# Altium project Led Strip 2 colors.PrjPcb
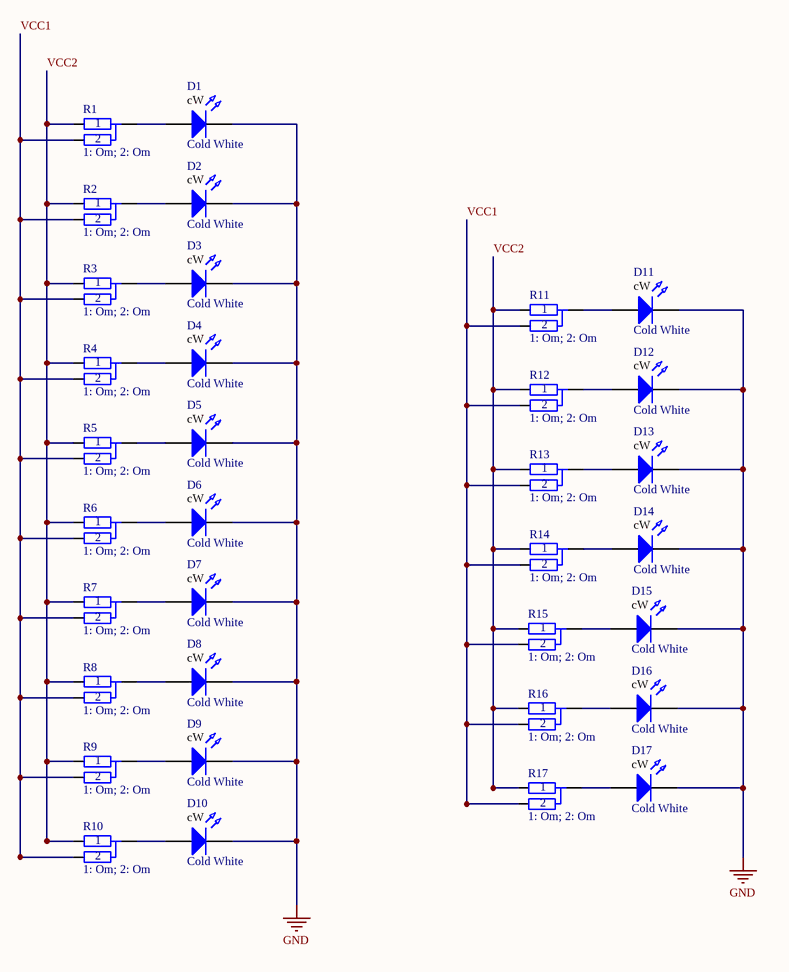
[diagram p0: Led Strip 2 colors.SchDoc]
2 sheets, 78 parts. Net scope: global (net labels, ports and power ports of the same name join across sheets).
Board files: Led Strip 2 colors.PcbDoc, Led Strip 2 colors Long.PcbDoc, Led Strip 2 colors HD.PcbDoc, Led Strip 5730 - 100mm.PcbDoc
Sheets:
  Led Strip 2 colors.SchDoc
  Led Strip 5630.SchDoc

## Sheet Led Strip 2 colors.SchDoc
size A4

### Parts
D1  Cold White  [LED SMD 5050 White compact R]
D2  Cold White  [LED SMD 5050 White compact R]
D3  Cold White  [LED SMD 5050 White compact R]
D4  Cold White  [LED SMD 5050 White compact R]
D5  Cold White  [LED SMD 5050 White compact R]
D6  Cold White  [LED SMD 5050 White compact R]
D7  Cold White  [LED SMD 5050 White compact R]
D8  Cold White  [LED SMD 5050 White compact R]
D9  Cold White  [LED SMD 5050 White compact R]
D10  Cold White  [LED SMD 5050 White compact R]
D11  Cold White  [LED SMD 5050 White compact R]
D12  Cold White  [LED SMD 5050 White compact R]
D13  Cold White  [LED SMD 5050 White compact R]
D14  Cold White  [LED SMD 5050 White compact R]
D15  Cold White  [LED SMD 5050 White compact R]
D16  Cold White  [LED SMD 5050 White compact R]
D17  Cold White  [LED SMD 5050 White compact R]
R1  1: Om; 2: Om  [SMD 0805 (2012) Double]
R2  1: Om; 2: Om  [SMD 0805 (2012) Double]
R3  1: Om; 2: Om  [SMD 0805 (2012) Double]
R4  1: Om; 2: Om  [SMD 0805 (2012) Double]
R5  1: Om; 2: Om  [SMD 0805 (2012) Double]
R6  1: Om; 2: Om  [SMD 0805 (2012) Double]
R7  1: Om; 2: Om  [SMD 0805 (2012) Double]
R8  1: Om; 2: Om  [SMD 0805 (2012) Double]
R9  1: Om; 2: Om  [SMD 0805 (2012) Double]
R10  1: Om; 2: Om  [SMD 0805 (2012) Double]
R11  1: Om; 2: Om  [SMD 0805 (2012) Double]
R12  1: Om; 2: Om  [SMD 0805 (2012) Double]
R13  1: Om; 2: Om  [SMD 0805 (2012) Double]
R14  1: Om; 2: Om  [SMD 0805 (2012) Double]
R15  1: Om; 2: Om  [SMD 0805 (2012) Double]
R16  1: Om; 2: Om  [SMD 0805 (2012) Double]
R17  1: Om; 2: Om  [SMD 0805 (2012) Double]

### Nets
GND: D1.K D2.K D3.K D4.K D5.K D6.K D7.K D8.K D9.K D10.K D11.K D12.K D13.K D14.K D15.K D16.K D17.K
VCC1: R1.2 R2.2 R3.2 R4.2 R5.2 R6.2 R7.2 R8.2 R9.2 R10.2 R11.2 R12.2 R13.2 R14.2 R15.2 R16.2 R17.2
VCC2: R1.1 R2.1 R3.1 R4.1 R5.1 R6.1 R7.1 R8.1 R9.1 R10.1 R11.1 R12.1 R13.1 R14.1 R15.1 R16.1 R17.1
NetD1_A: D1.A R1.3
NetD2_A: D2.A R2.3
NetD3_A: D3.A R3.3
NetD4_A: D4.A R4.3
NetD5_A: D5.A R5.3
NetD6_A: D6.A R6.3
NetD7_A: D7.A R7.3
NetD8_A: D8.A R8.3
NetD9_A: D9.A R9.3
NetD10_A: D10.A R10.3
NetD11_A: D11.A R11.3
NetD12_A: D12.A R12.3
NetD13_A: D13.A R13.3
NetD14_A: D14.A R14.3
NetD15_A: D15.A R15.3
NetD16_A: D16.A R16.3
NetD17_A: D17.A R17.3

### Notes on the sheet
- (in symbol Led SMD White Cold) cW

### Library data of the parts
D1-D17 = Led SMD White Cold: ?3v ?20mA; Forward Voltage TYP: ?3; Resistor for 5v VCC: 240 Om; Forward Voltage Min: ?; Wave len min/typ: ?; Liminous Min (mcd): ?; Liminous Typ (mcd): ?; Forward Amp (mA): ?; Color: Cold White
R1-R17 = Res SMD (Select one way): Choice from two resistors

## Sheet Led Strip 5630.SchDoc: Led Strip 5630
size A4; Revision: 0; SheetNumber: 1; SheetTotal: 1; Version: 1.0; Variant: Led 5630 3x in section; Modification: Modification; Project: Led Strip
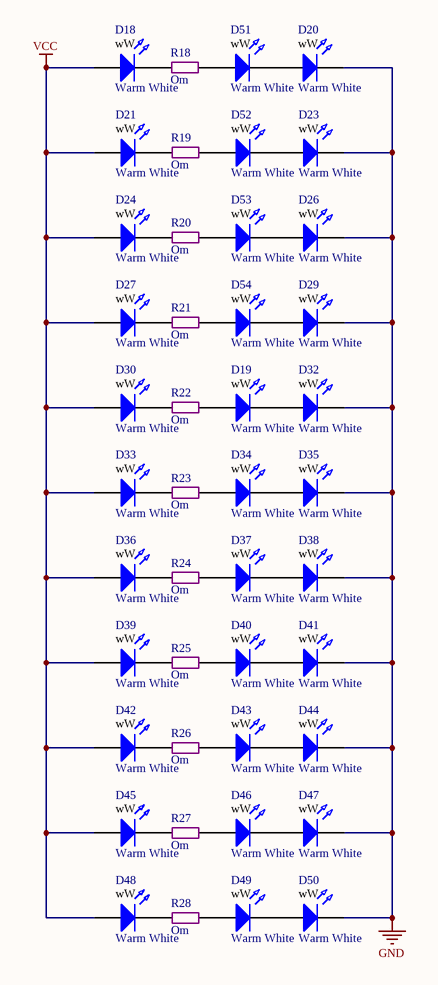
[diagram p1: Led Strip 5630.SchDoc]

### Parts
D18  Warm White  [LED SMD 5730 White]
D19  Warm White  [LED SMD 5730 White]
D20  Warm White  [LED SMD 5730 White]
D21  Warm White  [LED SMD 5730 White]
D23  Warm White  [LED SMD 5730 White]
D24  Warm White  [LED SMD 5730 White]
D26  Warm White  [LED SMD 5730 White]
D27  Warm White  [LED SMD 5730 White]
D29  Warm White  [LED SMD 5730 White]
D30  Warm White  [LED SMD 5730 White]
D32  Warm White  [LED SMD 5730 White]
D33  Warm White  [LED SMD 5730 White]
D34  Warm White  [LED SMD 5730 White]
D35  Warm White  [LED SMD 5730 White]
D36  Warm White  [LED SMD 5730 White]
D37  Warm White  [LED SMD 5730 White]
D38  Warm White  [LED SMD 5730 White]
D39  Warm White  [LED SMD 5730 White]
D40  Warm White  [LED SMD 5730 White]
D41  Warm White  [LED SMD 5730 White]
D42  Warm White  [LED SMD 5730 White]
D43  Warm White  [LED SMD 5730 White]
D44  Warm White  [LED SMD 5730 White]
D45  Warm White  [LED SMD 5730 White]
D46  Warm White  [LED SMD 5730 White]
D47  Warm White  [LED SMD 5730 White]
D48  Warm White  [LED SMD 5730 White]
D49  Warm White  [LED SMD 5730 White]
D50  Warm White  [LED SMD 5730 White]
D51  Warm White  [LED SMD 5730 White]
D52  Warm White  [LED SMD 5730 White]
D53  Warm White  [LED SMD 5730 White]
D54  Warm White  [LED SMD 5730 White]
R18  Om  [SMD 1206 (3216)]
R19  Om  [SMD 1206 (3216)]
R20  Om  [SMD 1206 (3216)]
R21  Om  [SMD 1206 (3216)]
R22  Om  [SMD 1206 (3216)]
R23  Om  [SMD 1206 (3216)]
R24  Om  [SMD 1206 (3216)]
R25  Om  [SMD 1206 (3216)]
R26  Om  [SMD 1206 (3216)]
R27  Om  [SMD 1206 (3216)]
R28  Om  [SMD 1206 (3216)]

### Nets
GND: D20.K D23.K D26.K D29.K D32.K D35.K D38.K D41.K D44.K D47.K D50.K
VCC: D18.A D21.A D24.A D27.A D30.A D33.A D36.A D39.A D42.A D45.A D48.A
NetD18_K: D18.K R18.1
NetD19_A: D19.A R22.2
NetD19_K: D19.K D32.A
NetD20_A: D20.A D51.K
NetD21_K: D21.K R19.1
NetD23_A: D23.A D52.K
NetD24_K: D24.K R20.1
NetD26_A: D26.A D53.K
NetD27_K: D27.K R21.1
NetD29_A: D29.A D54.K
NetD30_K: D30.K R22.1
NetD33_K: D33.K R23.1
NetD34_A: D34.A R23.2
NetD34_K: D34.K D35.A
NetD36_K: D36.K R24.1
NetD37_A: D37.A R24.2
NetD37_K: D37.K D38.A
NetD39_K: D39.K R25.1
NetD40_A: D40.A R25.2
NetD40_K: D40.K D41.A
NetD42_K: D42.K R26.1
NetD43_A: D43.A R26.2
NetD43_K: D43.K D44.A
NetD45_K: D45.K R27.1
NetD46_A: D46.A R27.2
NetD46_K: D46.K D47.A
NetD48_K: D48.K R28.1
NetD49_A: D49.A R28.2
NetD49_K: D49.K D50.A
NetD51_A: D51.A R18.2
NetD52_A: D52.A R19.2
NetD53_A: D53.A R20.2
NetD54_A: D54.A R21.2

### Notes on the sheet
- Ver:
- Rev:
- Sheet
- of
- File:
- (in symbol Led SMD White Warm) wW

### Library data of the parts
D18-D21 D23 D24 D26 D27 D29 D30 D32-D54 = Led SMD White Warm: ?3v ?20mA; Forward Voltage TYP: ?3; Resistor for 5v VCC: 240 Om; Forward Voltage Min: ?; Wave len min/typ: ?; Liminous Min (mcd): ?; Liminous Typ (mcd): ?; Forward Amp (mA): ?; Color: Warm White
R18-R28 = Res SMD 1206

## Nets that join several sheets
GND: Led Strip 2 colors (17 pins), Led Strip 5630 (11 pins)